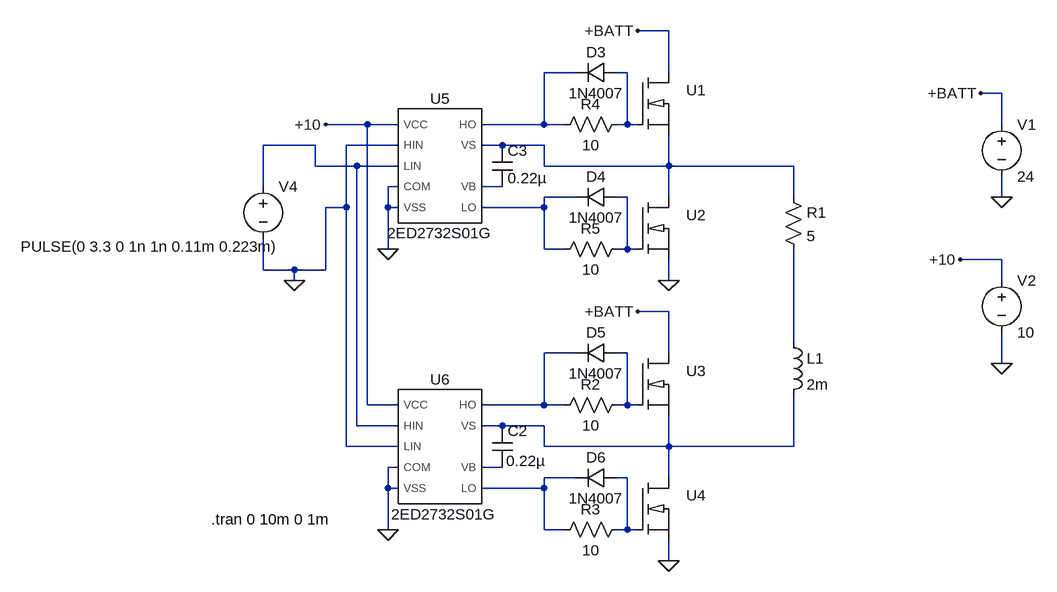
[diagram p0: schematic Motor_Driver.asc]
Motor_Driver.asc, the LTspice schematic file:
Version 4
SHEET 1 1968 1220
WIRE 176 32 128 32
WIRE 32 96 -16 96
WIRE 112 96 96 96
WIRE 176 96 176 32
WIRE 688 128 656 128
WIRE -288 176 -352 176
WIRE -240 176 -288 176
WIRE -16 176 -16 96
WIRE -16 176 -112 176
WIRE 16 176 -16 176
WIRE 112 176 112 96
WIRE 112 176 96 176
WIRE 128 176 112 176
WIRE 688 176 688 128
WIRE -368 208 -448 208
WIRE -240 208 -320 208
WIRE -80 208 -112 208
WIRE -16 208 -80 208
WIRE -368 240 -368 208
WIRE -304 240 -368 240
WIRE -240 240 -304 240
WIRE -16 240 -16 208
WIRE 176 240 176 192
WIRE 176 240 -16 240
WIRE 368 240 176 240
WIRE -448 272 -448 208
WIRE -240 272 -256 272
WIRE -80 272 -112 272
WIRE 32 288 -16 288
WIRE 112 288 96 288
WIRE 176 288 176 240
WIRE 368 288 368 240
WIRE 688 288 688 256
WIRE -320 304 -320 208
WIRE -320 304 -352 304
WIRE -256 304 -256 272
WIRE -240 304 -256 304
WIRE -16 304 -16 288
WIRE -16 304 -112 304
WIRE -256 368 -256 304
WIRE -16 368 -16 304
WIRE 16 368 -16 368
WIRE 112 368 112 288
WIRE 112 368 96 368
WIRE 128 368 112 368
WIRE 688 384 624 384
WIRE -448 400 -448 352
WIRE -400 400 -448 400
WIRE -352 400 -352 304
WIRE -352 400 -400 400
WIRE -400 416 -400 400
WIRE 176 416 176 384
WIRE 688 416 688 384
WIRE 176 464 128 464
WIRE 368 512 368 368
WIRE 32 528 -16 528
WIRE 112 528 96 528
WIRE 176 528 176 464
WIRE 688 544 688 496
WIRE -288 608 -288 176
WIRE -240 608 -288 608
WIRE -16 608 -16 528
WIRE -16 608 -112 608
WIRE 16 608 -16 608
WIRE 112 608 112 528
WIRE 112 608 96 608
WIRE 128 608 112 608
WIRE -304 640 -304 240
WIRE -240 640 -304 640
WIRE -80 640 -112 640
WIRE -16 640 -80 640
WIRE -320 672 -320 304
WIRE -240 672 -320 672
WIRE -16 672 -16 640
WIRE 176 672 176 624
WIRE 176 672 -16 672
WIRE 368 672 368 592
WIRE 368 672 176 672
WIRE -240 704 -256 704
WIRE -80 704 -112 704
WIRE 32 720 -16 720
WIRE 112 720 96 720
WIRE 176 720 176 672
WIRE -256 736 -256 704
WIRE -240 736 -256 736
WIRE -16 736 -16 720
WIRE -16 736 -112 736
WIRE -256 800 -256 736
WIRE -16 800 -16 736
WIRE 16 800 -16 800
WIRE 112 800 112 720
WIRE 112 800 96 800
WIRE 128 800 112 800
WIRE 176 848 176 816
FLAG 176 848 0
FLAG 128 464 +BATT
FLAG 128 32 +BATT
FLAG 688 288 0
FLAG 656 128 +BATT
FLAG -256 368 0
FLAG -256 800 0
FLAG -352 176 +10
FLAG -400 416 0
FLAG 176 416 0
FLAG 688 544 0
FLAG 624 384 +10
SYMBOL voltage 688 160 R0
WINDOW 123 0 0 Left 0
WINDOW 39 24 124 Left 2
SYMATTR InstName V1
SYMATTR Value 24
SYMBOL MD_Models\\irfh8324pbf 160 768 R0
WINDOW 3 97 -1 Invisible 2
SYMATTR InstName U4
SYMBOL res 352 272 R0
SYMATTR InstName R1
SYMATTR Value 5
SYMBOL MD_Models\\irfh8324pbf 160 144 R0
WINDOW 3 97 -1 Invisible 2
SYMATTR InstName U1
SYMBOL MD_Models\\irfh8324pbf 160 336 R0
WINDOW 3 97 -1 Invisible 2
SYMATTR InstName U2
SYMBOL MD_Models\\irfh8324pbf 160 576 R0
WINDOW 3 97 -1 Invisible 2
SYMATTR InstName U3
SYMBOL cap -96 640 R0
WINDOW 3 22 54 Left 2
SYMATTR Value 0.22µ
SYMATTR InstName C2
SYMBOL cap -96 208 R0
WINDOW 3 24 51 Left 2
SYMATTR Value 0.22µ
SYMATTR InstName C3
SYMBOL res 112 592 R90
WINDOW 0 0 56 VBottom 2
WINDOW 3 32 56 VTop 2
SYMATTR InstName R2
SYMATTR Value 10
SYMBOL res 112 784 R90
WINDOW 0 0 56 VBottom 2
WINDOW 3 32 56 VTop 2
SYMATTR InstName R3
SYMATTR Value 10
SYMBOL res 112 160 R90
WINDOW 0 0 56 VBottom 2
WINDOW 3 32 56 VTop 2
SYMATTR InstName R4
SYMATTR Value 10
SYMBOL res 112 352 R90
WINDOW 0 0 56 VBottom 2
WINDOW 3 32 56 VTop 2
SYMATTR InstName R5
SYMATTR Value 10
SYMBOL voltage -448 256 R0
WINDOW 3 -373 108 Left 2
WINDOW 123 0 0 Left 0
WINDOW 39 0 0 Left 0
SYMATTR Value PULSE(0 3.3 0 1n 1n 0.11m 0.223m)
SYMATTR InstName V4
SYMBOL diode 96 80 R90
WINDOW 0 0 32 VBottom 2
WINDOW 3 32 32 VTop 2
SYMATTR InstName D3
SYMATTR Value 1N4007
SYMBOL diode 96 272 R90
WINDOW 0 0 32 VBottom 2
WINDOW 3 32 32 VTop 2
SYMATTR InstName D4
SYMATTR Value 1N4007
SYMBOL diode 96 512 R90
WINDOW 0 0 32 VBottom 2
WINDOW 3 32 32 VTop 2
SYMATTR InstName D5
SYMATTR Value 1N4007
SYMBOL diode 96 704 R90
WINDOW 0 0 32 VBottom 2
WINDOW 3 32 32 VTop 2
SYMATTR InstName D6
SYMATTR Value 1N4007
SYMBOL ind 352 496 R0
SYMATTR InstName L1
SYMATTR Value 2m
SYMBOL MD_Models\\2ED2732S01G -176 240 R0
SYMATTR InstName U5
SYMBOL MD_Models\\2ED2732S01G -176 672 R0
WINDOW 3 6 89 Top 2
SYMATTR InstName U6
SYMBOL voltage 688 400 R0
WINDOW 123 0 0 Left 0
WINDOW 39 0 0 Left 0
SYMATTR InstName V2
SYMATTR Value 10
TEXT -528 784 Left 2 !.tran 0 10m 0 1m

The netlist it stands for:
* Motor_Driver.asc
V1 +BATT 0 24
XU4 N011 N014 0 IRFH8324PBF  ; pins 1 2 3
R1 N004 N008 5
XU1 +BATT N002 N004 IRFH8324PBF  ; pins 1 2 3
XU2 N004 N007 0 IRFH8324PBF  ; pins 1 2 3
XU3 +BATT N010 N011 IRFH8324PBF  ; pins 1 2 3
C2 N011 N012 0.22µ
C3 N004 N005 0.22µ
R2 N010 N009 10
R3 N014 N013 10
R4 N002 N001 10
R5 N007 N006 10
V4 N003 0 PULSE(0 3.3 0 1n 1n 0.11m 0.223m)
D3 N002 N001 1N4007
D4 N007 N006 1N4007
D5 N010 N009 1N4007
D6 N014 N013 1N4007
L1 N008 N011 2m
XU5 N006 N001 0 0 N003 0 +10 N005 N004 2ED2732S01G  ; pins LO HO COM VSS LIN HIN VCC VB VS
XU6 N013 N009 0 0 0 N003 +10 N012 N011 2ED2732S01G  ; pins LO HO COM VSS LIN HIN VCC VB VS
V2 +10 0 10
.model D D
.lib standard.dio
.tran 0 10m 0 1m
.lib IRFH8324PBF.txt
.lib 2ED2732S01G.txt
.backanno
.end